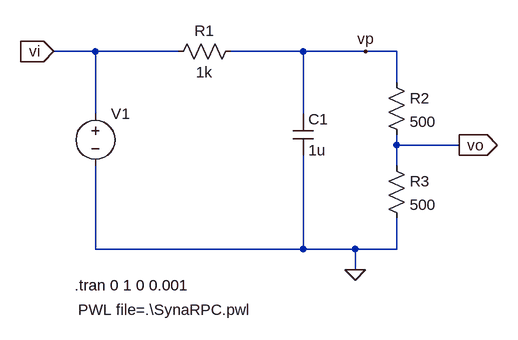
[diagram p0: schematic SynaRPC.asc]
SynaRPC.asc, the LTspice schematic file:
Version 4
SHEET 1 880 680
WIRE -256 32 -320 32
WIRE -128 32 -256 32
WIRE 64 32 -48 32
WIRE 160 32 64 32
WIRE 208 32 160 32
WIRE 208 80 208 32
WIRE -256 128 -256 32
WIRE 64 128 64 32
WIRE 208 176 208 160
WIRE 304 176 208 176
WIRE 208 208 208 176
WIRE -256 336 -256 208
WIRE 64 336 64 192
WIRE 64 336 -256 336
WIRE 144 336 64 336
WIRE 208 336 208 288
WIRE 208 336 144 336
WIRE 144 368 144 336
FLAG 144 368 0
FLAG 304 176 vo
IOPIN 304 176 Out
FLAG -320 32 vi
IOPIN -320 32 In
FLAG 160 32 vp
SYMBOL res 192 64 R0
SYMATTR InstName R2
SYMATTR Value 500
SYMBOL cap 48 128 R0
SYMATTR InstName C1
SYMATTR Value 1u
SYMBOL res -32 16 R90
WINDOW 0 0 56 VBottom 2
WINDOW 3 32 56 VTop 2
SYMATTR InstName R1
SYMATTR Value 1k
SYMBOL res 192 192 R0
SYMATTR InstName R3
SYMATTR Value 500
SYMBOL voltage -256 112 R0
WINDOW 3 -27 317 Left 2
WINDOW 123 0 0 Left 0
WINDOW 39 0 0 Left 0
SYMATTR Value PWL file=.\SynaRPC.pwl
SYMATTR InstName V1
TEXT -288 392 Left 2 !.tran 0 1 0 0.001

The netlist it stands for:
* SynaRPC.asc
R2 vp vo 500
C1 vp 0 1u
R1 vp vi 1k
R3 vo 0 500
V1 vi 0 PWL file=.\SynaRPC.pwl
.tran 0 1 0 0.001
.backanno
.end